# EAGLE schematic 18thF (EAGLE 9.6.2)
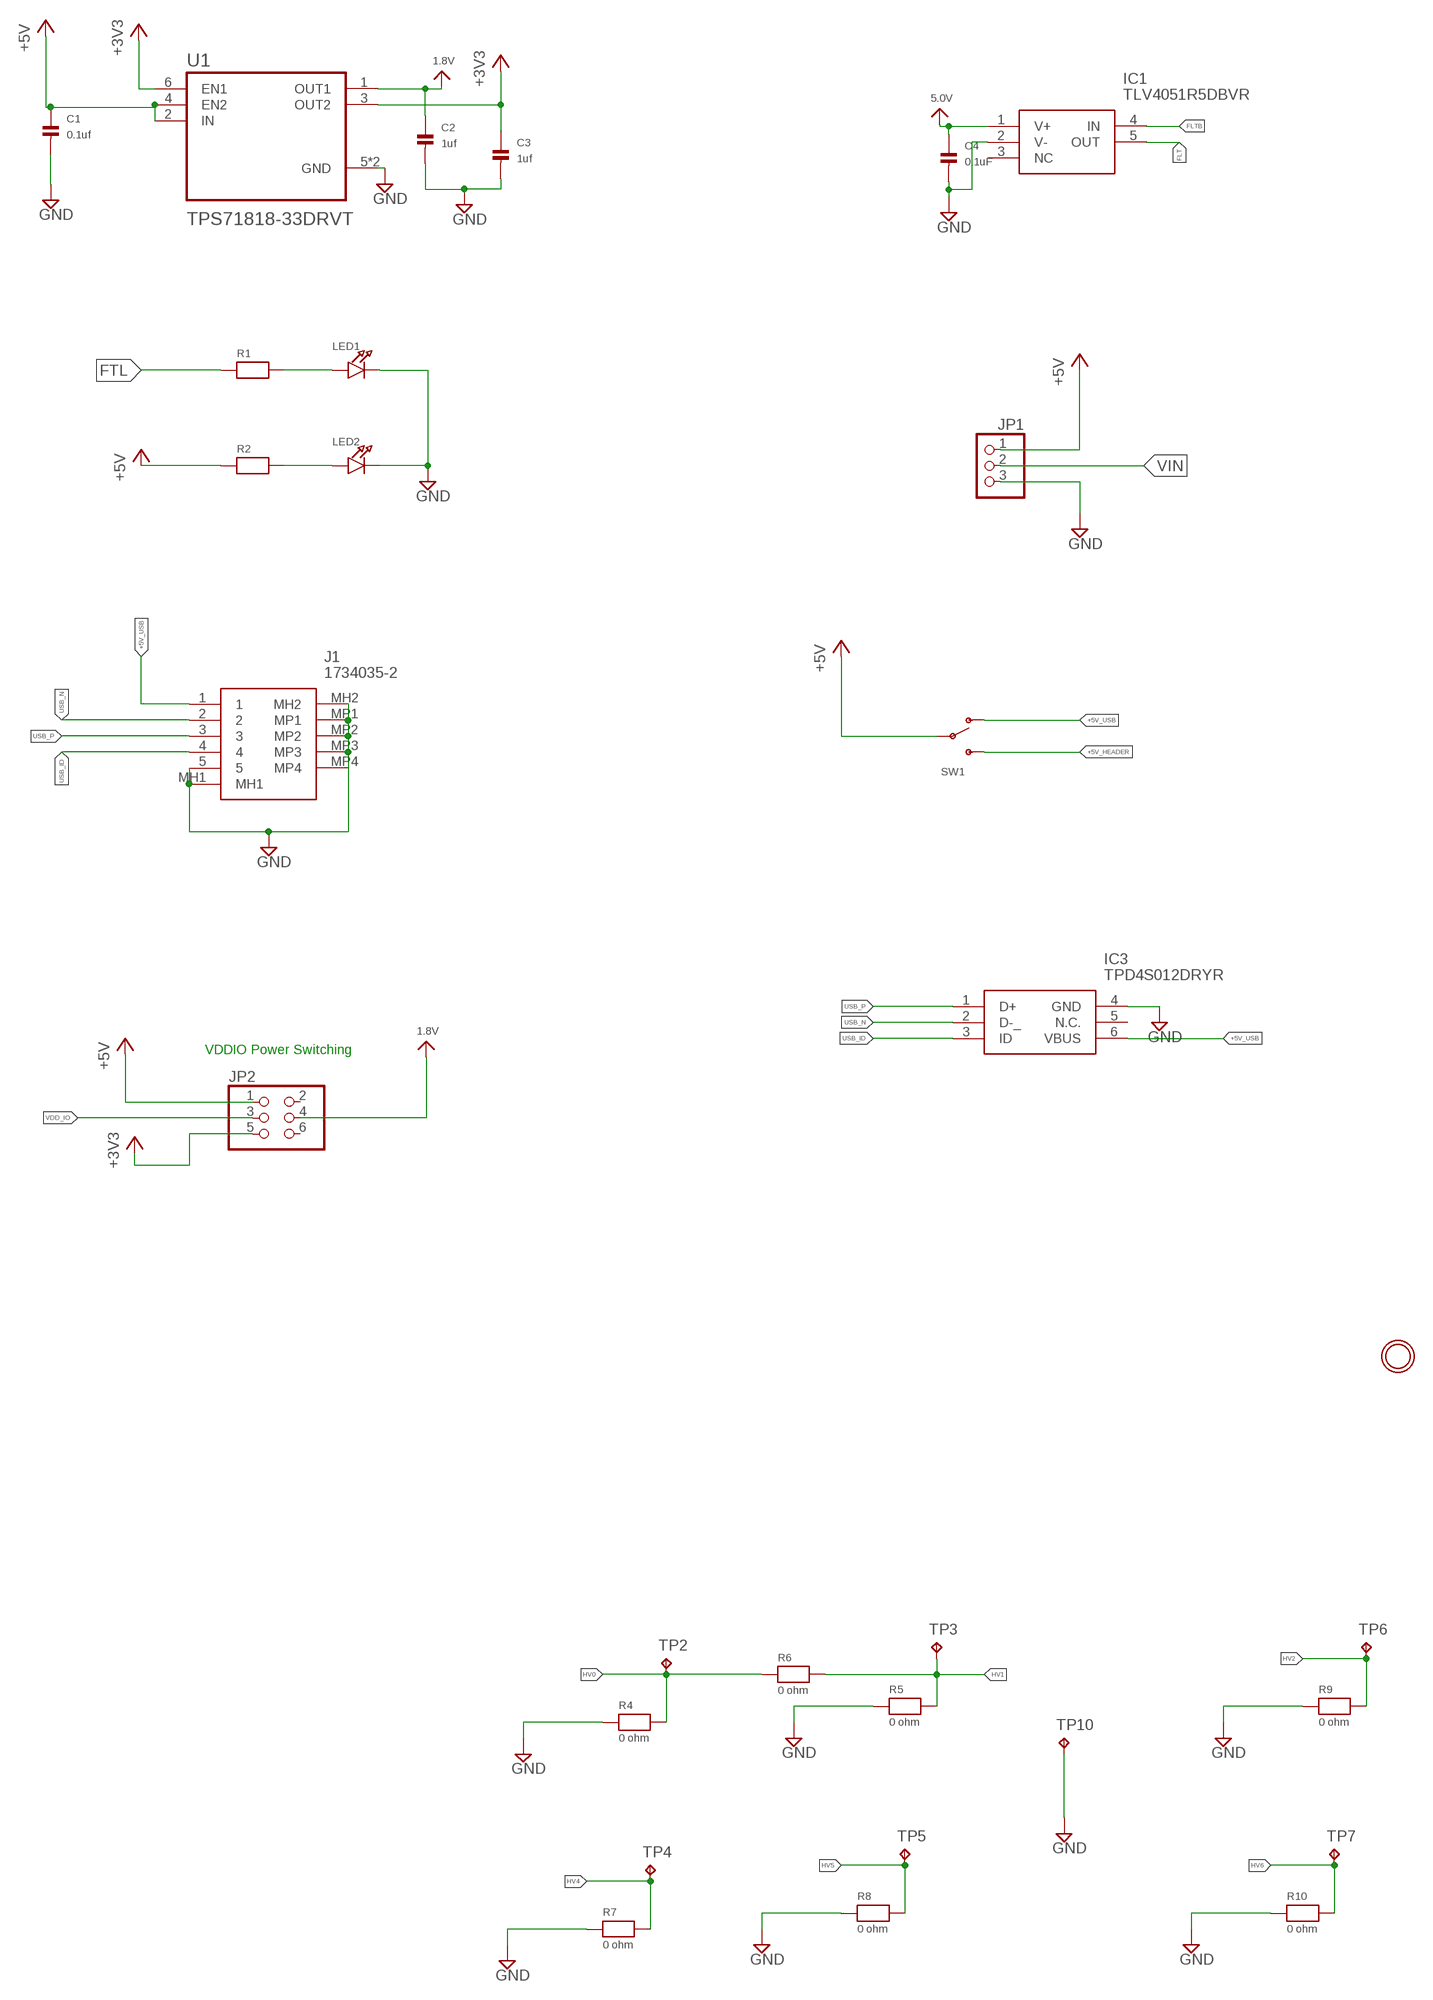
[diagram p0: schematic, sheet 1, part 1 of 2]
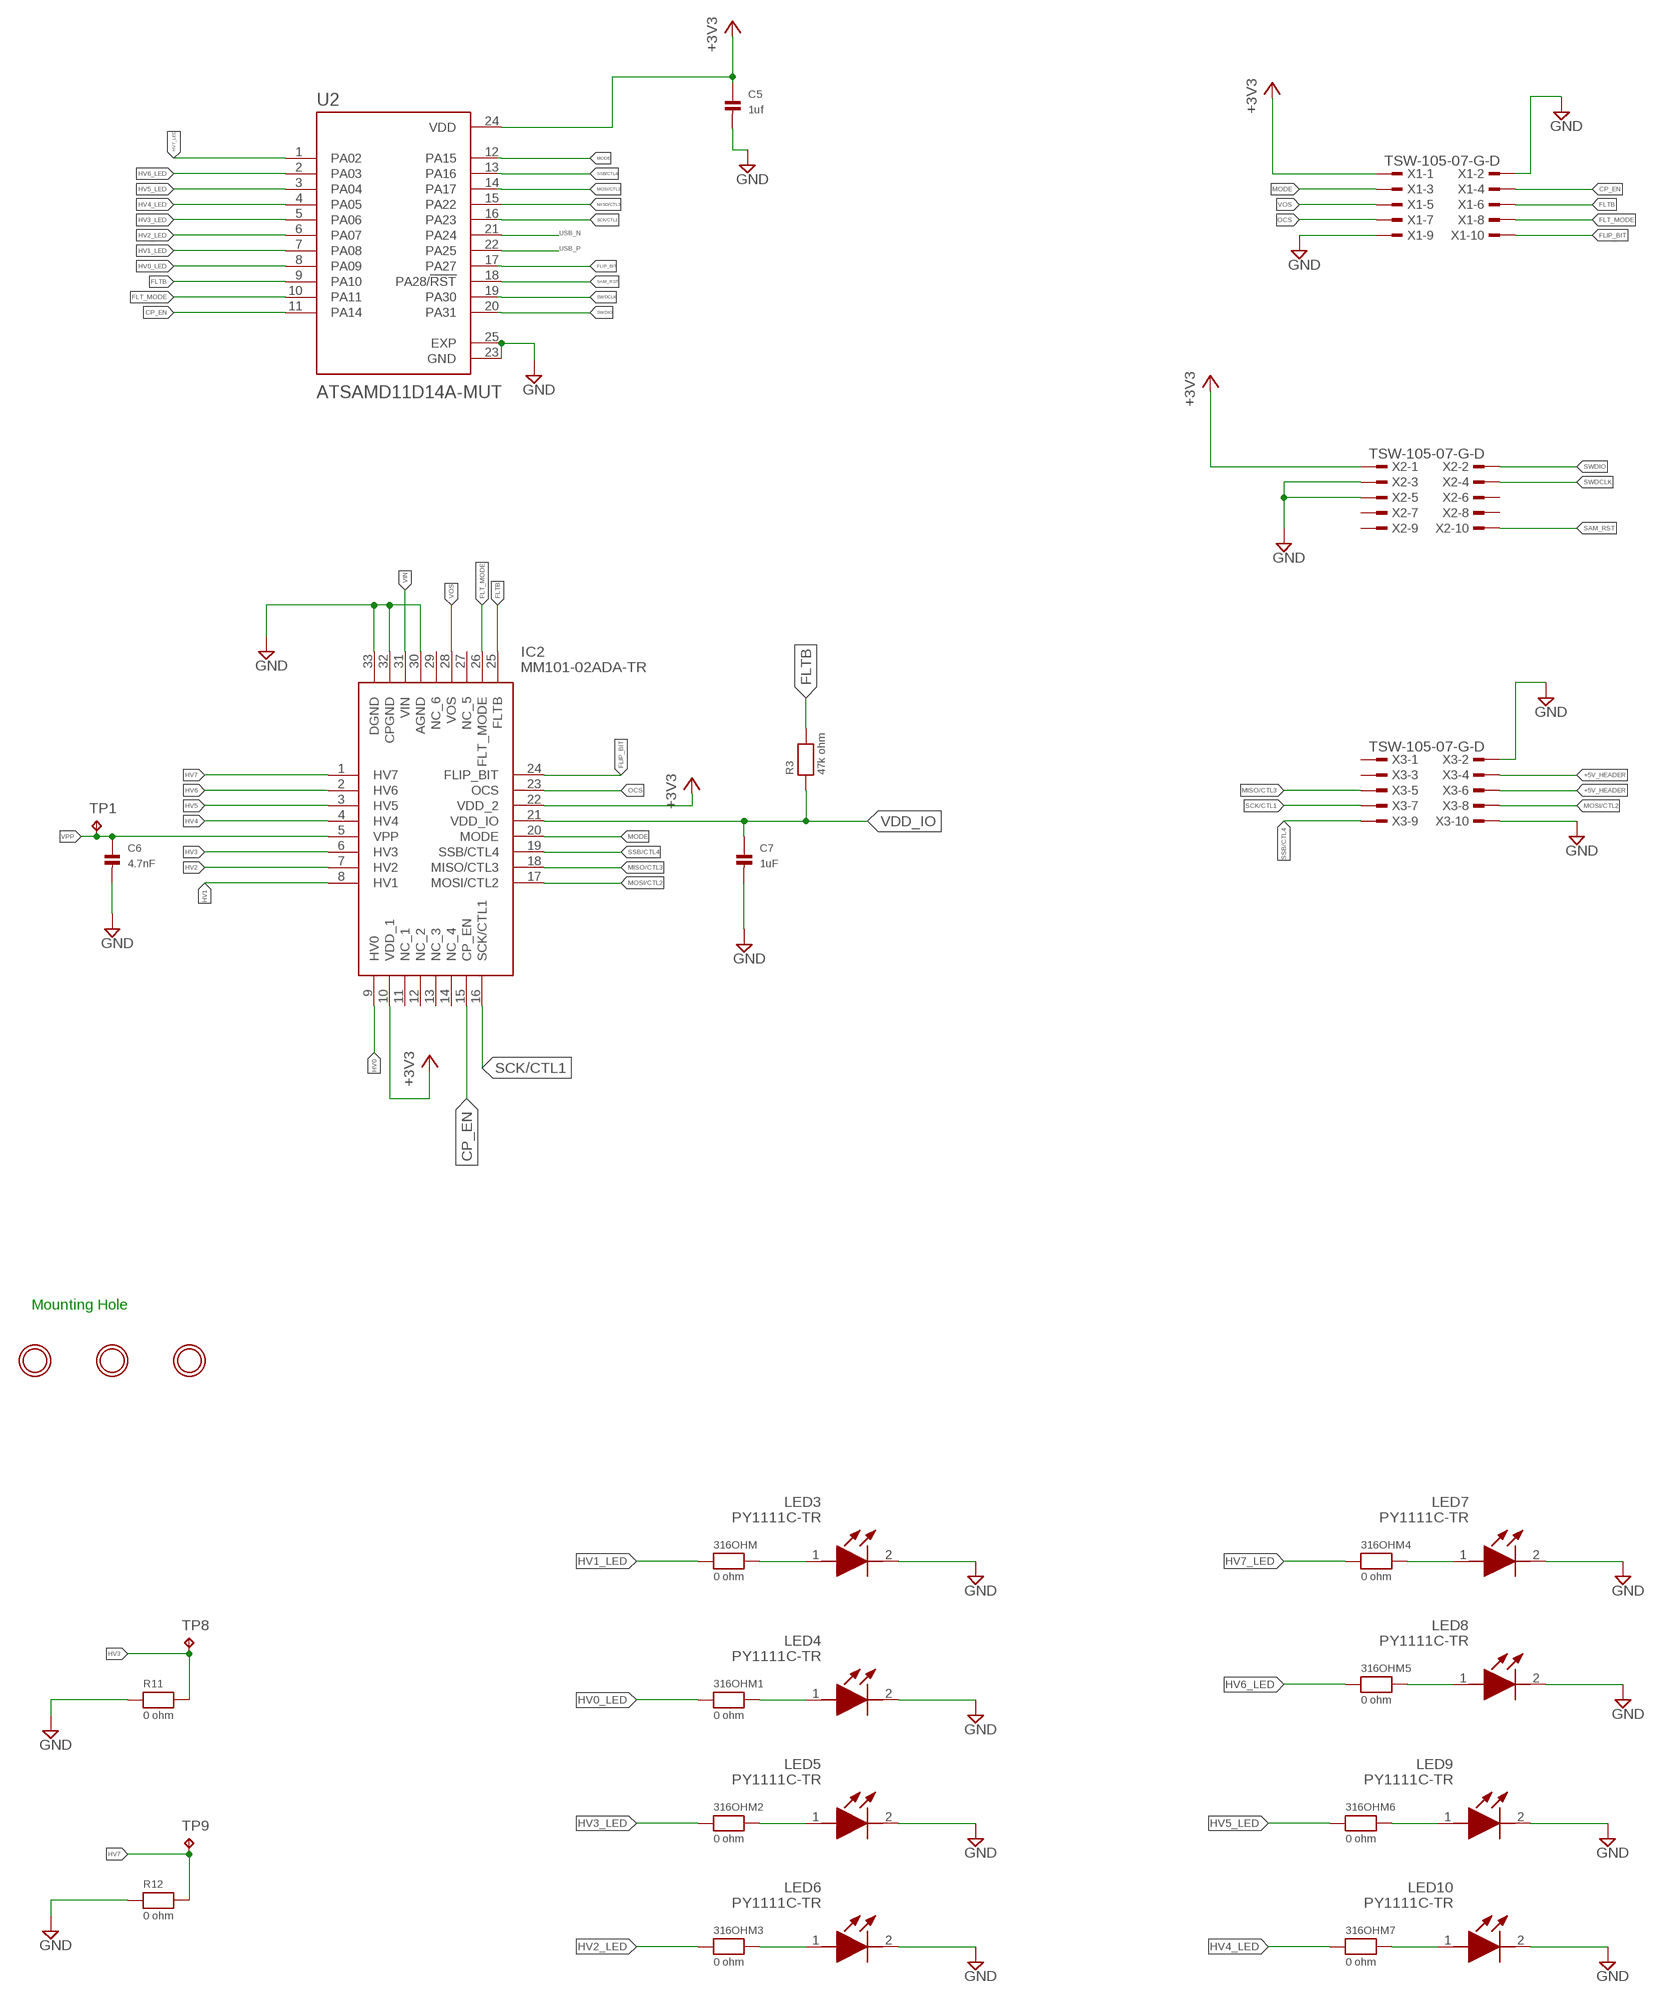
[diagram p1: schematic, sheet 1, part 2 of 2]

## Parts
316OHM  0 ohm  RESISTOR0603  [0603]
316OHM1  0 ohm  RESISTOR0603  [0603]
316OHM2  0 ohm  RESISTOR0603  [0603]
316OHM3  0 ohm  RESISTOR0603  [0603]
316OHM4  0 ohm  RESISTOR0603  [0603]
316OHM5  0 ohm  RESISTOR0603  [0603]
316OHM6  0 ohm  RESISTOR0603  [0603]
316OHM7  0 ohm  RESISTOR0603  [0603]
C1  0.1uf  CAP_CERAMIC0603  [0603]
C2  1uf  CAP_CERAMIC0603  [0603]
C3  1uf  CAP_CERAMIC0603  [0603]
C4  0.1uF  CAP_CERAMIC0603  [0603]
C5  1uf  CAP_CERAMIC0603  [0603]
C6  4.7nF  CAP_CERAMIC0603  [0603]
C7  1uF  CAP_CERAMIC0603  [0603]
IC1  TLV4051R5DBVR  [SOT95P280X145-5N]
IC2  MM101-02ADA-TR  [QFN50P500X500X100-33N]
IC3  TPD4S012DRYR  [TPD4S012DRYR]
J1  1734035-2  [17340352]
JP1  HEADER-1X3ROUND  [1X03_ROUND]
JP2  PINHD-2X3  [2X03]
LED1  LED0603_NOOUTLINE  [CHIPLED_0603_NOOUTLINE]
LED2  LED0603_NOOUTLINE  [CHIPLED_0603_NOOUTLINE]
LED3  PY1111C-TR  [PY1111CTR]
LED4  PY1111C-TR  [PY1111CTR]
LED5  PY1111C-TR  [PY1111CTR]
LED6  PY1111C-TR  [PY1111CTR]
LED7  PY1111C-TR  [PY1111CTR]
LED8  PY1111C-TR  [PY1111CTR]
LED9  PY1111C-TR  [PY1111CTR]
LED10  PY1111C-TR  [PY1111CTR]
R1  RESISTOR0603  [0603]
R2  RESISTOR0603  [0603]
R3  47k ohm  RESISTOR0603  [0603]
R4  0 ohm  RESISTOR0603  [0603]
R5  0 ohm  RESISTOR0603  [0603]
R6  0 ohm  RESISTOR0603  [0603]
R7  0 ohm  RESISTOR0603  [0603]
R8  0 ohm  RESISTOR0603  [0603]
R9  0 ohm  RESISTOR0603  [0603]
R10  0 ohm  RESISTOR0603  [0603]
R11  0 ohm  RESISTOR0603  [0603]
R12  0 ohm  RESISTOR0603  [0603]
SW1  SWITCH_SPDT  [SPDT_SMT_SSSS811101]
TP1  TPB1,27  [B1,27]
TP2  TPB1,27  [B1,27]
TP3  TPB1,27  [B1,27]
TP4  TPB1,27  [B1,27]
TP5  TPB1,27  [B1,27]
TP6  TPB1,27  [B1,27]
TP7  TPB1,27  [B1,27]
TP8  TPB1,27  [B1,27]
TP9  TPB1,27  [B1,27]
TP10  TPB1,27  [B1,27]
U1  TPS71818-33DRVT  [SON65P200X200X80-7N]
U2  ATSAMD11D14A-MUT  [QFN50P400X400X90-25N]
U$4  MOUNTINGHOLE2.5  [MOUNTINGHOLE_2.5_PLATED]
U$5  MOUNTINGHOLE2.5  [MOUNTINGHOLE_2.5_PLATED]
U$6  MOUNTINGHOLE2.5  [MOUNTINGHOLE_2.5_PLATED]
U$7  MOUNTINGHOLE2.5  [MOUNTINGHOLE_2.5_PLATED]
X1  TSW-105-07-G-D  [TSW-105-XX-G-D]
X2  TSW-105-07-G-D  [TSW-105-XX-G-D]
X3  TSW-105-07-G-D  [TSW-105-XX-G-D]

## Nets
1.8V: C2.1 JP2.4 U1.1(OUT1)
5.0V: C4.1 IC1.1(V+)
+3V3: C3.1 C5.1 IC2.10(VDD_1) IC2.22(VDD_2) JP2.5 U1.3(OUT2) U1.6(EN1) U2.24(VDD) X1.1 X2.1
+5V: C1.1 JP1.1 JP2.1 R2.1 SW1.B(P) U1.2(IN) U1.4(EN2)
+5V_HEADER: SW1.C(S) X3.4 X3.6
+5V_USB: IC3.6(VBUS) J1.1 SW1.A(O)
CP_EN: IC2.15(CP_EN) U2.11(PA14) X1.4
FLIP_BIT: IC2.24(FLIP_BIT) X1.10
FLT: IC1.5(OUT)
FLT_MODE: IC2.26(FLT_MODE) U2.10(PA11) X1.8
FLTB: IC1.4(IN) IC2.25(FLTB) R3.2 U2.9(PA10) X1.6
FTL: R1.1
GND: C1.2 C2.2 C3.2 C4.2 C5.2 C6.2 C7.2 IC1.2(V-) IC2.30(AGND) IC2.32(CPGND) IC2.33(DGND) IC3.4(GND) J1.5 J1.MH1 J1.MH2 J1.MP1 J1.MP2 J1.MP3 J1.MP4 JP1.3 LED1.C LED2.C LED3.2(K) LED4.2(K) LED5.2(K) LED6.2(K) LED7.2(K) LED8.2(K) LED9.2(K) LED10.2(K) R4.1 R5.1 R7.1 R8.1 R9.1 R10.1 R11.1 R12.1 TP10.TP U1.5(GND) U1.7(GND) U2.23(GND) U2.25(EXP) X1.2 X1.9 X2.3 X2.5 X3.2 X3.10
HV0: IC2.9(HV0) R4.2 R6.1 TP2.TP
HV0_LED: 316OHM1.1 U2.8(PA09)
HV1: IC2.8(HV1) R5.2 R6.2 TP3.TP
HV1_LED: 316OHM.1 U2.7(PA08)
HV2: IC2.7(HV2) R9.2 TP6.TP
HV2_LED: 316OHM3.1 U2.6(PA07)
HV3: IC2.6(HV3) R11.2 TP8.TP
HV3_LED: 316OHM2.1 U2.5(PA06)
HV4: IC2.4(HV4) R7.2 TP4.TP
HV4_LED: 316OHM7.1 U2.4(PA05)
HV5: IC2.3(HV5) R8.2 TP5.TP
HV5_LED: 316OHM6.1 U2.3(PA04)
HV6: IC2.2(HV6) R10.2 TP7.TP
HV6_LED: 316OHM5.1 U2.2(PA03)
HV7: IC2.1(HV7) R12.2 TP9.TP
HV7_LED: 316OHM4.1 U2.1(PA02)
MISO/CTL3: IC2.18(MISO/CTL3) U2.15(PA22) X3.5
MODE: IC2.20(MODE) U2.12(PA15) X1.3
MOSI/CTL2: IC2.17(MOSI/CTL2) U2.14(PA17) X3.8
N$2: LED1.A R1.2
N$14: LED2.A R2.2
N$18: U2.16(PA23)
N$21: U2.17(PA27)
N$23: U2.19(PA30)
N$24: U2.20(PA31)
N$30: 316OHM.2 LED3.1(A)
N$32: 316OHM1.2 LED4.1(A)
N$33: 316OHM2.2 LED5.1(A)
N$34: 316OHM3.2 LED6.1(A)
N$35: 316OHM4.2 LED7.1(A)
N$36: 316OHM5.2 LED8.1(A)
N$37: 316OHM6.2 LED9.1(A)
N$38: 316OHM7.2 LED10.1(A)
OCS: IC2.23(OCS) X1.7
SAM_RST: U2.18(PA28/!RST) X2.10
SCK/CTL1: IC2.16(SCK/CTL1) X3.7
SSB/CTL4: IC2.19(SSB/CTL4) U2.13(PA16) X3.9
SWDCLK: X2.4
SWDIO: X2.2
USB_ID: IC3.3(ID) J1.4
USB_N: IC3.2(D-_) J1.2 U2.21(PA24)
USB_P: IC3.1(D+) J1.3 U2.22(PA25)
VDD_IO: C7.1 IC2.21(VDD_IO) JP2.3 R3.1
VIN: IC2.31(VIN) JP1.2
VOS: IC2.28(VOS) X1.5
VPP: C6.1 IC2.5(VPP) TP1.TP
Unconnected: IC1.3(NC) IC2.11(NC_1) IC2.12(NC_2) IC2.13(NC_3) IC2.14(NC_4) IC2.27(NC_5) IC2.29(NC_6) IC3.5(N.C.) JP2.2 JP2.6 X2.6 X2.7 X2.8 X2.9 X3.1 X3.3

## Notes on the sheet
- VDDIO Power Switching
- Mounting Hole

## Library data of the parts
316OHM 316OHM1-316OHM7 R1-R12 = microbuilder:RESISTOR: Resistors 0402 - 0402 Surface Mount Package 22 Ohm 1% 1/16W [Digikey: 311-22.0LRTR-ND] 33 Ohm 5% 1/16W 1.0K 5% 1/16W 1.5K 5% 1/16W 2.0K 1% 1/16W 10.0K 1% 1/16W [Digikey: 311-10.0KLRTR-ND] 10.0K 5% 1/16W [Digikey: RMCF0402JT10K0TR-ND] 12.1K 1% 1/16W [Digikey: 311-22.0LRTR-ND] 100.0K 5% 1/16W 0603 - 0603 Surface Mount Package 0 Ohm 1/10 Watt 1% Resistor 15 Ohm 1/10 Watt 1% Resistor 33 Ohm 1/10 Watt 1% Resistor 49.9 Ohm 1/10 Watt 1% Resistor 100 Ohm 1/10 Watt 1% Resistor 150 Ohm 1/10 Watt 1% Resistor 240 Ohm 1/10 Watt 1% Resistor 390 Ohm 1/10 Watt 1% Resistor 560 Ohm 1/10 Watt 1% Resistor 680 Ohm 1/10 Watt 1% Resistor 750 Ohm 1/10 Watt 1% Resistor 1.0K Ohm 1/10 Watt 1% Resistor 1.5K Ohm 1/10 Watt 1% Resistor 2.0K Ohm 1/10 Watt 1% Resistor 2.2K Ohm 1/10 Watt 1% Resistor 3.3K Ohm 1/10 Watt 1% Resistor 4.7K Ohm 1/10 Watt 1% Resistor 10.0K Ohm 1/10 Watt 1% Resistor 12.0K Ohm 1/10 Watt 1% Resistor 12.1K Ohm 1/10 Watt 1% Resistor 20.0K Ohm 1/10 Watt 1% Resistor 33.0K Ohm 1/10 Watt 1% Resistor 100.0K Ohm 1/10 Watt 1% Resistor 0805 - 0805 Surface Mount Package 0 Ohm 1/8 Watt 1% Resistor 33 Ohm 1/8 Watt 1% Resistor 100 Ohm 1/8 Watt 1% Resistor 150 Ohm 1/8 Watt 1% Resistor 200 Ohm 1/8 Watt 1% Resistor 240 Ohm 1/8 Watt 1% Resistor 330 Ohm 1/8 Watt 1% Resistor 390 Ohm 1/8 Watt 1% Resistor 470 Ohm 1/8 Watt 1% Resistor 1.0K Ohm 1/8 Watt 1% Resistor 1.5K Ohm 1/8 Watt 1% Resistor 2.0K Ohm 1/8 Watt 1% Resistor 4.7K Ohm 1/8 Watt 1% Resistor 5.1K Ohm 1/8 Watt 1% Resistor 5.6K Ohm 1/8 Watt 1% Resistor 10.0K Ohm 1/8 Watt 1% Resistor 22.0K Ohm 1/8 Watt 1% Resistor 33.0K Ohm 1/8 Watt 1% Resistor 100K Ohm 1/8 Watt 1% Resistor 1206 - 1206 Surface Mount Package 2012 - 2010 Surface Mount Package 0.11 Ohm 1/2 Watt 1% Resistor - Digikey: RHM.11UCT-ND
C1-C7 = microbuilder:CAP_CERAMIC: Ceramic Capacitors 0402 - 0402 Surface Mount Capacitors 16pF 50V 5% [Digikey: 445-4899-2-ND] 18pF 50V 5% [Digikey: 490-1281-2-ND] 22pF 50V 5% [Digikey: 490-1283-2-ND] 68pF 50V 5% [Digikey: 490-1289-2-ND] 0.1uF 10V 10% [Digikey: 490-1318-2-ND] 1.0uF 6.3V 10% [Digikey: 490-1320-2-ND] 0603 - 0603 Surface Mount Capacitors 16 pF 50V 5% [Digikey: 445-5051-2-ND] 22 pF 50V [Digikey: PCC220ACVTR-ND] 33 pF 50V 5% [Digikey: 490-1415-1-ND] 56pF 50V 5% [Digikey: 490-1421-1-ND] 220pF 50V 5% [Digikey: 445-1285-1-ND] 680 pF 50V 2200 pF 50V 5% C0G [Digikey: 445-1297-1-ND] 5600 pF 100V 5% X7R [Digikey: 478-3711-1-ND] 0.1 µF 25V 10% [Digikey: PCC2277TR-ND] 0.22 µF 16V 10% X7R [Digikey: 445-1318-1-ND] 1.0 µF 25V 10% [Digikey: 445-5146-2-ND] 0603 - RF Specific 3pF 250V +/-0.1pF RF [Digikey: 712-1347-1-ND] 18 pF 250V 5% [Digikey: 478-3505-1-ND or 712-1322-1-ND] 56 pF 250V 5% C0G RF [Digikey: 490-4867-1-ND] 68 pF 250V RF [Digikey: 490-4868-1-ND] 0805 - 0805 Surface Mount Capacitors 220 pF 250V 2% RF Ceramic Capacitor [Digikey: 712-1398-1-ND] 1000 pF 50V 2% NP0 Ceramic Capacitor [Digikey: 478-3760-1-ND] 0.1 µF 25V 10% Ceramic Capacitor [Digikey: PCC1828TR-ND] 1.0 µF 16V 10% Ceramic Capacitor[Digikey: 490-1691-2-ND] 10.0 µF 10V 10% Ceramic Capacitor[Digikey: 709-1228-1-ND] 10.0 uF 16V 10% Ceramic Capacitor [Digikey: 478-5165-2-ND] 47 uF 6.3V 20% Ceramic Capacitor [Digikey: 587-1779-1-ND or 399-5506-1-ND] 1206 - 1206 Surface Mount Capacitors 47uF 10V 20% Ceramic Capacitor [Digikey: 490-5528-1-ND or 399-5508-1-ND or 445-6010-1-ND] 100uF 6.3V -20%, +80% Y5V Ceramic Capacitor (Digikey: 490-4512-1-ND, Mouser: 81-GRM31CF50J107ZE1L)
IC1 = TLV4051R5DBVR:TLV4051R5DBVR: Analog Comparators Source: Datasheet <https://www.ti.com/lit/ds/symlink/tlv4051.pdf?ts=1620806023631&ref_url=https%3A%2F%2Feu.mouser.com%2F>; DESCRIPTION: Analog Comparators; HEIGHT: 1.45mm; MANUFACTURER_NAME: Texas Instruments; MANUFACTURER_PART_NUMBER: TLV4051R5DBVR; MOUSER_PART_NUMBER: 595-TLV4051R5DBVR; MOUSER_PRICE-STOCK: https://www.mouser.co.uk/ProductDetail/Texas-Instruments/TLV4051R5DBVR?qs=yqaQSyyJnNja5IMcENT91w%3D%3D
IC2 = MM101-02ADA-TR:MM101-02ADA-TR: Switching Voltage Regulators 8ch Charge Pump Driver IC - QFN Source: Datasheet <https://www.mouser.com/c/?marcom=151145542>; DESCRIPTION: Switching Voltage Regulators 8ch Charge Pump Driver IC - QFN; HEIGHT: 1mm; MANUFACTURER_NAME: Menlo Microsystems, Inc.; MANUFACTURER_PART_NUMBER: MM101-02ADA-TR; MOUSER_PART_NUMBER: 899-MM101-02ADA-TR; MOUSER_PRICE-STOCK: https://www.mouser.co.uk/ProductDetail/Menlo-Micro/MM101-02ADA-TR?qs=amGC7iS6iy%2F0TQ2O5UwmSQ%3D%3D
IC3 = TPD4S012DRYR:TPD4S012DRYR: ESD Suppressors / TVS Diodes 4Ch USB ESD Solution w/ Pwr Clamp Source: Datasheet <https://www.ti.com/lit/gpn/TPD4S012>; ARROW_PART_NUMBER: TPD4S012DRYR; ARROW_PRICE-STOCK: https://www.arrow.com/en/products/tpd4s012dryr/texas-instruments?region=nac; DESCRIPTION: ESD Suppressors / TVS Diodes 4Ch USB ESD Solution w/ Pwr Clamp; HEIGHT: 0.6mm; MANUFACTURER_NAME: Texas Instruments; MANUFACTURER_PART_NUMBER: TPD4S012DRYR; MOUSER_PART_NUMBER: 595-TPD4S012DRYR; MOUSER_PRICE-STOCK: https://www.mouser.co.uk/ProductDetail/Texas-Instruments/TPD4S012DRYR?qs=XGzIaZb%2FFYJve%2FbrCpoVgg%3D%3D
J1 = 1734035-2:1734035-2: Body Features: Offset 0 MM | Connector Profile Mini | Shell Plating Material Nickel | Configuration Features: Number of Ports 1 | Number of Positions 5 | Contact Features: Contact Mating Area Plating Material Gold Flash over Palladium Nickel | Contact Current Rating (Max) 1 AMP | Contact Mating Area Plating Material Thickness .76 MICM | Contact Mating Area Plating Material Thickness 29.92 MICIN | Dimensions: PCB Thickness (Recommended) 1.57 MM | PCB Thickness (Recommended) .062 INCH | Housing Features: Cent Source: Datasheet <https://www.te.com/commerce/DocumentDelivery/DDEController?Action=srchrtrv&DocNm=1-1773453-6&DocType=Data Sheet&DocLang=English&PartCntxt=1734035-2&DocFormat=pdf>; ARROW_PART_NUMBER: 1734035-2; ARROW_PRICE-STOCK: https://www.arrow.com/en/products/1734035-2/te-connectivity?region=nac; DESCRIPTION: Body Features: Offset 0 MM | Connector Profile Mini | Shell Plating Material Nickel | Configuration Features: Number of Ports 1 | Number of Positions 5 | Contact Features: Contact Mating Area Plating Material Gold Flash over Palladium Nickel | Contact Current Rating (Max) 1 AMP | Contact Mating Area Plating Material Thickness .76 MICM | Contact Mating Area Plating Material Thickness 29.92 MICIN | Dimensions: PCB Thickness (Recommended) 1.57 MM | PCB Thickness (Recommended) .062 INCH | Housing Features: Cent; HEIGHT: 3.95mm; MANUFACTURER_NAME: TE Connectivity; MANUFACTURER_PART_NUMBER: 1734035-2; MOUSER_PART_NUMBER: 571-1734035-2; MOUSER_PRICE-STOCK: https://www.mouser.co.uk/ProductDetail/TE-Connectivity/1734035-2?qs=Lu3apKW7jUhaCoyjqYNFIA%3D%3D
JP1 = microbuilder:HEADER-1X3: PIN HEADER
JP2 = pinhead:PINHD-2X3: PIN HEADER
LED1 LED2 = microbuilder:LED: LED 0603 - 0603 Surface Mount Package 2mA: Green LED - Low Power (3.9mcd, 2ma, 1.7Vf) - Digikey: 475-2709-2-ND Orange LED - Low Power (9.8mcd, 2ma, 1.8Vf) - Digikey: 475-1194-2-ND Red LED - Low Power (5mcd, 2ma, 1.8Vf) - Digikey: 475-1195-2-ND Yellow LED - Low Power (7mcd, 2ma, 1.8Vf) - Digikey: 475-1196-2-ND 5mA: Blue LED - Low Power (17mcd, 5ma, 2.9Vf) - Digikey: LNJ937W8CRACT-ND 0805 - 0805 Surface Mount Package 2mA: Red LED (8.8mcd, 2mA, 1.8Vf, Clear) - Low Power [Digikey: 475-2510-1-ND] Green LED (5mcd, 2mA, 1.8Vf, Clear) - Low Power [Digikey: 475-2730-1-ND] Yellow LED (11.3mcd, 2mA, 1.8Vf, Clear) - Low Power [Digikey: 475-2555-1-ND] 20mA: Red LED (104mcd, 20mA, Diffused) - LS R976 [Digikey: 475-1278-6-ND] Red LED (12mcd, 20mA, 2.0Vf, Clear) - APT2012EC [Digikey: 754-1128-1-ND] Green LED (15mcd, 20mA, 2.2Vf, Clear) - APT2012GC [Digikey: 754-1131-1-ND] Orange LED (160mcd, 20mA, 2.1Vf, Clear) - APT2012SECK [Digikey: 754-1130-1-ND] 1206 - 1206 Surface Mount Package Green LED (26mcd, 20mA, Diffused) - LG N971 [Digikey: 475-1407-6-ND] Red LED (15mcd, 20mA, Diffused) - LH N974 [Digikey: 475-1416-6-ND]
LED3-LED10 = PY1111C-TR:PY1111C-TR: LED Uni-Color Yellow Green 570nm Automotive 2-Pin SMD T/R Source: Datasheet <https://componentsearchengine.com/Datasheets/1/PY1111C-TR.pdf>; ARROW_PART_NUMBER: PY1111C-TR; ARROW_PRICE-STOCK: https://www.arrow.com/en/products/py1111c-tr/stanley-electric?region=nac; DESCRIPTION: LED Uni-Color Yellow Green 570nm Automotive 2-Pin SMD T/R; HEIGHT: 0.8mm; MANUFACTURER_NAME: Stanley Electric; MANUFACTURER_PART_NUMBER: PY1111C-TR; MOUSER_PART_NUMBER: 327-PY1111CTR; MOUSER_PRICE-STOCK: https://www.mouser.co.uk/ProductDetail/Stanley-Electric/PY1111C-TR?qs=byeeYqUIh0PDxS2HVSqXtA%3D%3D
SW1 = microbuilder:SWITCH_SPDT: Switch - SPDT SSSS811101 - Horizontal Two Position SMT, 0.3A 4V [Mouser: 688-SSSS811101]
TP1-TP10 = testpad:TP: Test pad
U1 = TPS71818-33DRVT:TPS71818-33DRVT: Check availability <https://pricing.snapeda.com/parts/TPS71818-33DRVT/Texas%20Instruments/view-part?ref=eda>; AVAILABILITY: In Stock; CHECK_PRICES: https://www.snapeda.com/parts/TPS71818-33DRVT/Texas+Instruments/view-part/?ref=eda; DESCRIPTION: 200-mA, high-PSRR, dual-channel low-dropout voltage regulator with enable; MF: Texas Instruments; MP: TPS71818-33DRVT; PACKAGE: WSON-6 Texas Instruments; PRICE: None; SNAPEDA_LINK: https://www.snapeda.com/parts/TPS71818-33DRVT/Texas+Instruments/view-part/?ref=snap
U2 = ATSAMD11D14A-MUT:ATSAMD11D14A-MUT: None Buy Part <https://snapeda.com/parts/ATSAMD11D14A-MUT/Microchip/view-part/?ref=eda> Check availability <https://pricing.snapeda.com/parts/ATSAMD11D14A-MUT/Microchip%20Technology/view-part?ref=eda>; AVAILABILITY: In Stock; CHECK_PRICES: https://www.snapeda.com/parts/ATSAMD11D14A-MUT/Microchip/view-part/?ref=eda; DESCRIPTION: ARM® Cortex®-M0+ SAM D11D Microcontroller IC 32-Bit Single-Core 48MHz 16KB (16K x 8) FLASH 24-QFN (4x4); MF: Microchip Technology; MP: ATSAMD11D14A-MUT; PACKAGE: QFN-24 Microchip; PRICE: None; SNAPEDA_LINK: https://www.snapeda.com/parts/ATSAMD11D14A-MUT/Microchip/view-part/?ref=snap
U$4-U$7 = microbuilder:MOUNTINGHOLE: Mounting Hole For #2 screws (0.086"/2.18mm width, 0.094"/2.4mm hole) use 2.5mm
X1-X3 = con-samtec:TSW-105-*-G: THROUGH-HOLE .025" SQ POST HEADER Source: Samtec TSW.pdf; MF: Samtec Inc.; MPN: TSW-105-07-G-D